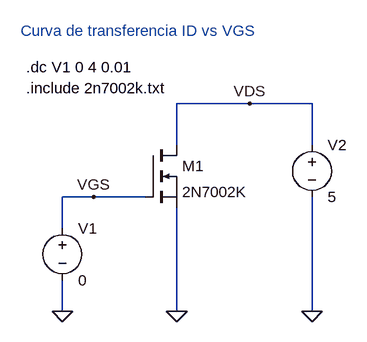
[diagram p0: schematic sim_nmos_transferencia.asc]
sim_nmos_transferencia.asc, the LTspice schematic file:
Version 4
SHEET 1 880 680
WIRE -336 -144 -448 -144
WIRE -240 -144 -336 -144
WIRE -448 -80 -448 -144
WIRE -240 -80 -240 -144
WIRE -576 0 -624 0
WIRE -496 0 -576 0
WIRE -624 48 -624 0
WIRE -624 176 -624 128
WIRE -448 176 -448 16
WIRE -240 176 -240 0
FLAG -576 0 VGS
FLAG -336 -144 VDS
FLAG -624 176 0
FLAG -448 176 0
FLAG -240 176 0
SYMBOL voltage -624 32 R0
SYMATTR InstName V1
SYMATTR Value 0
SYMBOL nmos -496 -80 R0
SYMATTR InstName M1
SYMATTR Value 2N7002K
SYMATTR Prefix X
SYMBOL voltage -240 -96 R0
WINDOW 123 0 0 Left 0
WINDOW 39 0 0 Left 0
SYMATTR InstName V2
SYMATTR Value 5
TEXT -680 -168 Left 2 !.include 2n7002k.txt
TEXT -680 -200 Left 2 !.dc V1 0 4 0.01
TEXT -688 -256 Left 2 ;Curva de transferencia ID vs VGS

The netlist it stands for:
* sim_nmos_transferencia.asc
V1 VGS 0 0
XM1 VDS VGS 0 2N7002K  ; pins D G S
V2 VDS 0 5
.include 2n7002k.txt
.dc V1 0 4 0.01
* Curva de transferencia ID vs VGS
.backanno
.end

* Results of the author's LTspice run, read from the files saved beside the schematic
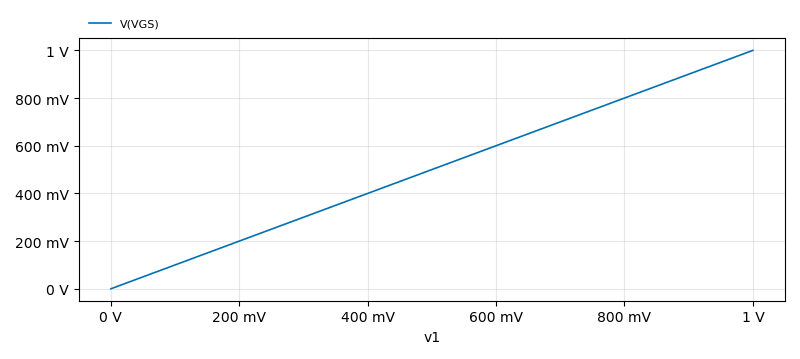
[diagram p1: DC transfer characteristic of sim_nmos_transferencia.asc, plotted from the saved traces]
* DC transfer characteristic, 1 run:
*   V(VGS): 0 V at v1=0 V, 1 V at v1=1 V, min 0 V, max 1 V